# EAGLE design GPS_Module (EAGLE 9.5.0)
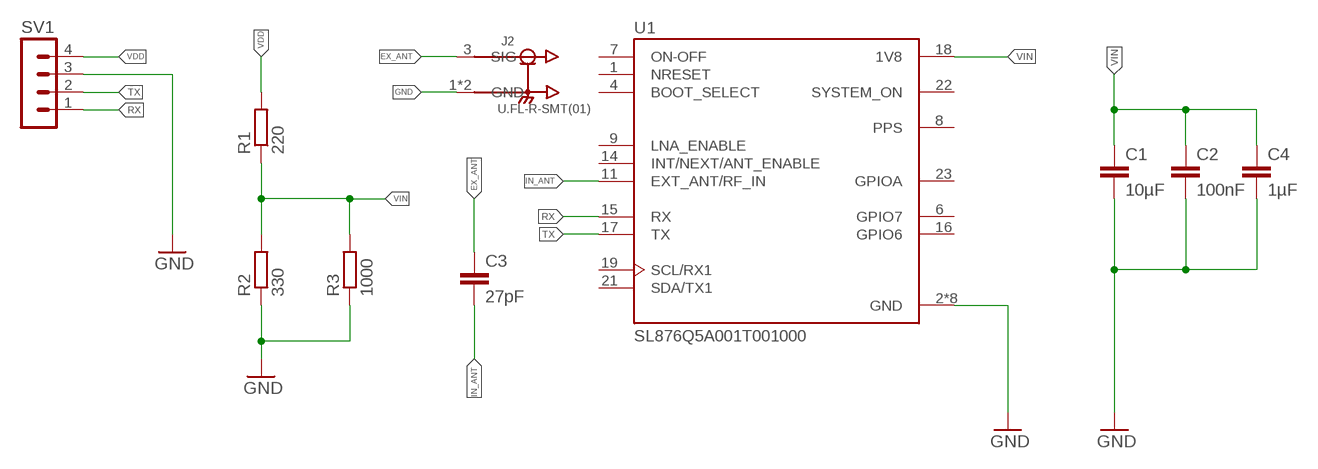
[diagram p0: schematic, sheet 1]

## Parts
C1  10µF  C-EUC0805  [C0805]
C2  100nF  C-EUC0805  [C0805]
C3  27pF  C-EUC0805  [C0805]
C4  1µF  C-EUC0805  [C0805]
J2  U.FL-R-SMT(01)  [HRS_U.FL-R-SMT(01)]
R1  220  R-EU_R0402  [R0402]
R2  330  R-EU_R0402  [R0402]
R3  1000  R-EU_R0402  [R0402]
SV1  MA04-1  [MA04-1]
U1  SL876Q5A001T001000  [XCVR_SL876Q5A001T001000]

## Nets
EX_ANT: C3.1 J2.3(SIG)
GND: C1.2 C2.2 C4.2 J2.1(GND) J2.2(GND) R2.1 R3.1 SV1.3 U1.2(GND) U1.3(GND) U1.5(GND) U1.10(GND) U1.12(GND) U1.13(GND) U1.20(GND) U1.24(GND)
IN_ANT: C3.2 U1.11(EXT_ANT/RF_IN)
RX: SV1.1 U1.15(RX)
TX: SV1.2 U1.17(TX)
VDD: R1.2 SV1.4
VIN: C1.1 C2.1 C4.1 R1.1 R2.2 R3.2 U1.18(1V8)
Unconnected: U1.1(NRESET) U1.4(BOOT_SELECT) U1.6(GPIO7) U1.7(ON-OFF) U1.8(PPS) U1.9(LNA_ENABLE) U1.14(INT/NEXT/ANT_ENABLE) U1.16(GPIO6) U1.19(SCL/RX1) U1.21(SDA/TX1) U1.22(SYSTEM_ON) U1.23(GPIOA)

## Library data of the parts
C1-C4 = rcl:C-EU: CAPACITOR, European symbol; SPICEPREFIX: C
J2 = U.FL-R-SMT_01_:U.FL-R-SMT(01): U.FL Series 6 Ghz 50 Ohm Ultra-small SMT Coaxial Cable Receptacle; AVAILABILITY: Unavailable; DESCRIPTION: U.FL Series 6 Ghz 50 Ohm Ultra-small SMT Coaxial Cable Receptacle; MF: Hirose; MP: U.FL-R-SMT_01_; PACKAGE: None; PRICE: None
R1-R3 = rcl:R-EU_: RESISTOR, European symbol; SPICEPREFIX: R
SV1 = con-lstb:MA04-1: PIN HEADER; OC_FARNELL: unknown; OC_NEWARK: unknown
U1 = SL876Q5A001T001000:SL876Q5A001T001000: Sl876q5-a Gnss Embedded Module; AVAILABILITY: Unavailable; DESCRIPTION: Sl876q5-a Gnss Embedded Module; MF: Telit; MP: SL876Q5A001T001000; PACKAGE: None; PRICE: None

## Board
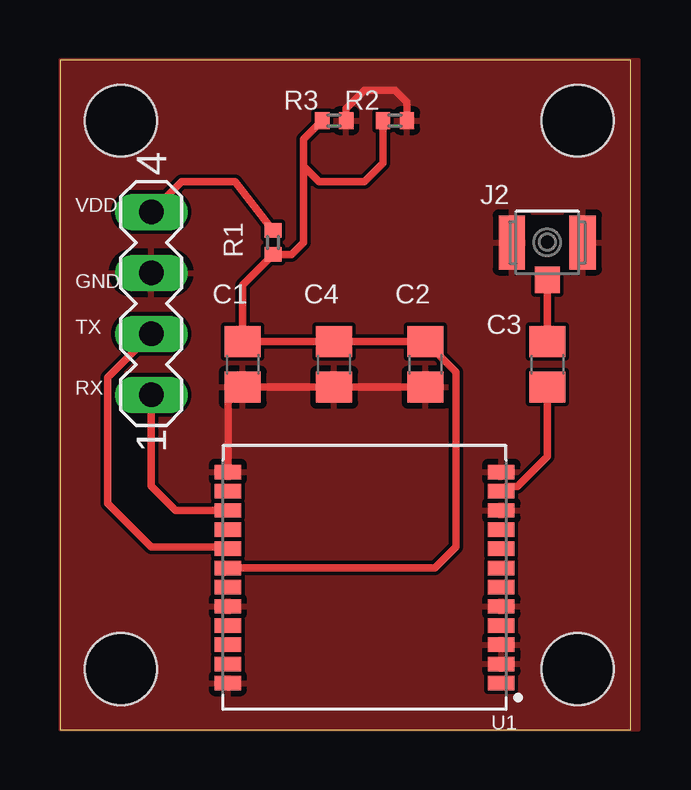
[diagram p1: board, top side]

Size 23.8 x 27.93 mm. Coordinates in mm from the lower left corner, seen from the top.
Outline: 0,27.92 0,0 23.8,0 23.8,27.93 0,27.92
Copper layers (1*16): Top 0.035mm / dielectric 1.5mm / Bottom 0.035mm
Design rules "default *": minimum track width 6mil, minimum drill 0.35mm, track to track 6mil, track to pad 6mil, pad to pad 6mil, via to via 6mil, smd to smd 6mil, copper to edge 0mil, drill to drill 6mil, minimum pad ring 10mil, minimum via ring 8mil, stop-mask expansion 4mil, vias tented up to drill 0mil, thermal gap 10mil
Holes 3 mm at 2.54,2.54 21.59,2.54 2.54,25.4 21.59,25.4

### Footprints (pad centres in the part's own frame; a part is rotated, then mirrored left to right if it is on the bottom)
C0805 = smd 1.3 x 1.5: 1 -0.95,0; 2 0.95,0
HRS_U.FL-R-SMT(01) = smd 1.1 x 2.25: 1 -1.475,0; 2 1.475,0 | smd 1.05 x 1.1: 3 0,-1.55
R0402 = smd 0.6 x 0.7: 1 -0.5,0; 2 0.5,0
MA04-1 = drill 1.016 long: 1 -3.81,0; 2 -1.27,0; 3 1.27,0; 4 3.81,0
XCVR_SL876Q5A001T001000 = smd 1.1 x 0.6: 1 -5.7,4.4; 2 -5.7,3.6; 3 -5.7,2.8; 4 -5.7,2; 5 -5.7,1.2; 6 -5.7,0.4; 7 -5.7,-0.4; 8 -5.7,-1.2; 9 -5.7,-2; 10 -5.7,-2.8; 11 -5.7,-3.6; 12 -5.7,-4.4; 13 5.7,-4.4; 14 5.7,-3.6; 15 5.7,-2.8; 16 5.7,-2; 17 5.7,-1.2; 18 5.7,-0.4; 19 5.7,0.4; 20 5.7,1.2; 21 5.7,2; 22 5.7,2.8; 23 5.7,3.6; 24 5.7,4.4

### Placement (x,y rotation side)
C1  7.62,15.24 270 top
C2  15.24,15.24 270 top
C3  20.32,15.24 270 top
C4  11.43,15.24 270 top
J2  20.32,20.32 0 top
R1  8.89,20.32 90 top
R2  13.97,25.4 180 top
R3  11.43,25.4 180 top
SV1  3.81,17.78 90 top
U1  12.7,6.35 180 top

### Tracks (layer width: path | path; a pad name or v marks a point on that pad's centre or on a via)
EX_ANT
  Top 0.305: J2.3 C3.1
GND
  Top 0.305: C2.2 C4.2 C1.2 7,13.67 U1.13 | R3.1 11.93,25.9 12.7,26.67 13.97,26.67 14.47,26.17 R2.1
  pour Top: 0,27.94 24.13,27.94 24.13,0 0,0
IN_ANT
  Top 0.305: U1.11 18.59,10.14 19.08,10.14 20.32,11.39 C3.2
RX
  Top 0.305: SV1.1 3.81,10.16 4.82,9.15 U1.15
TX
  Top 0.305: U1.17 6.93,7.62 3.81,7.62 1.98,9.45 1.98,14.68 SV1.2
VDD
  Top 0.305: SV1.4 5.08,22.86 7.3,22.86 R1.2
VIN
  Top 0.305: 7.62,16.51 7.62,18.55 R1.1 9.66,19.82 10.16,20.32 10.16,23.49 | 7.62,16.51 C1.1 | 6.8,6.55 U1.18 15.64,6.75 16.51,7.62 16.51,14.92 C2.1 C4.1 | 11.27,16.35 C4.1 | C4.1 7.94,16.19 7.62,16.51 | R3.2 10.16,24.63 10.16,23.49 | R2.2 13.47,23.63 12.7,22.86 10.79,22.86 10.16,23.49

### Text on the board
tNames: VDD | GND | TX | RX